# Altium schematic sheet Power Supply.SchDoc
size A4
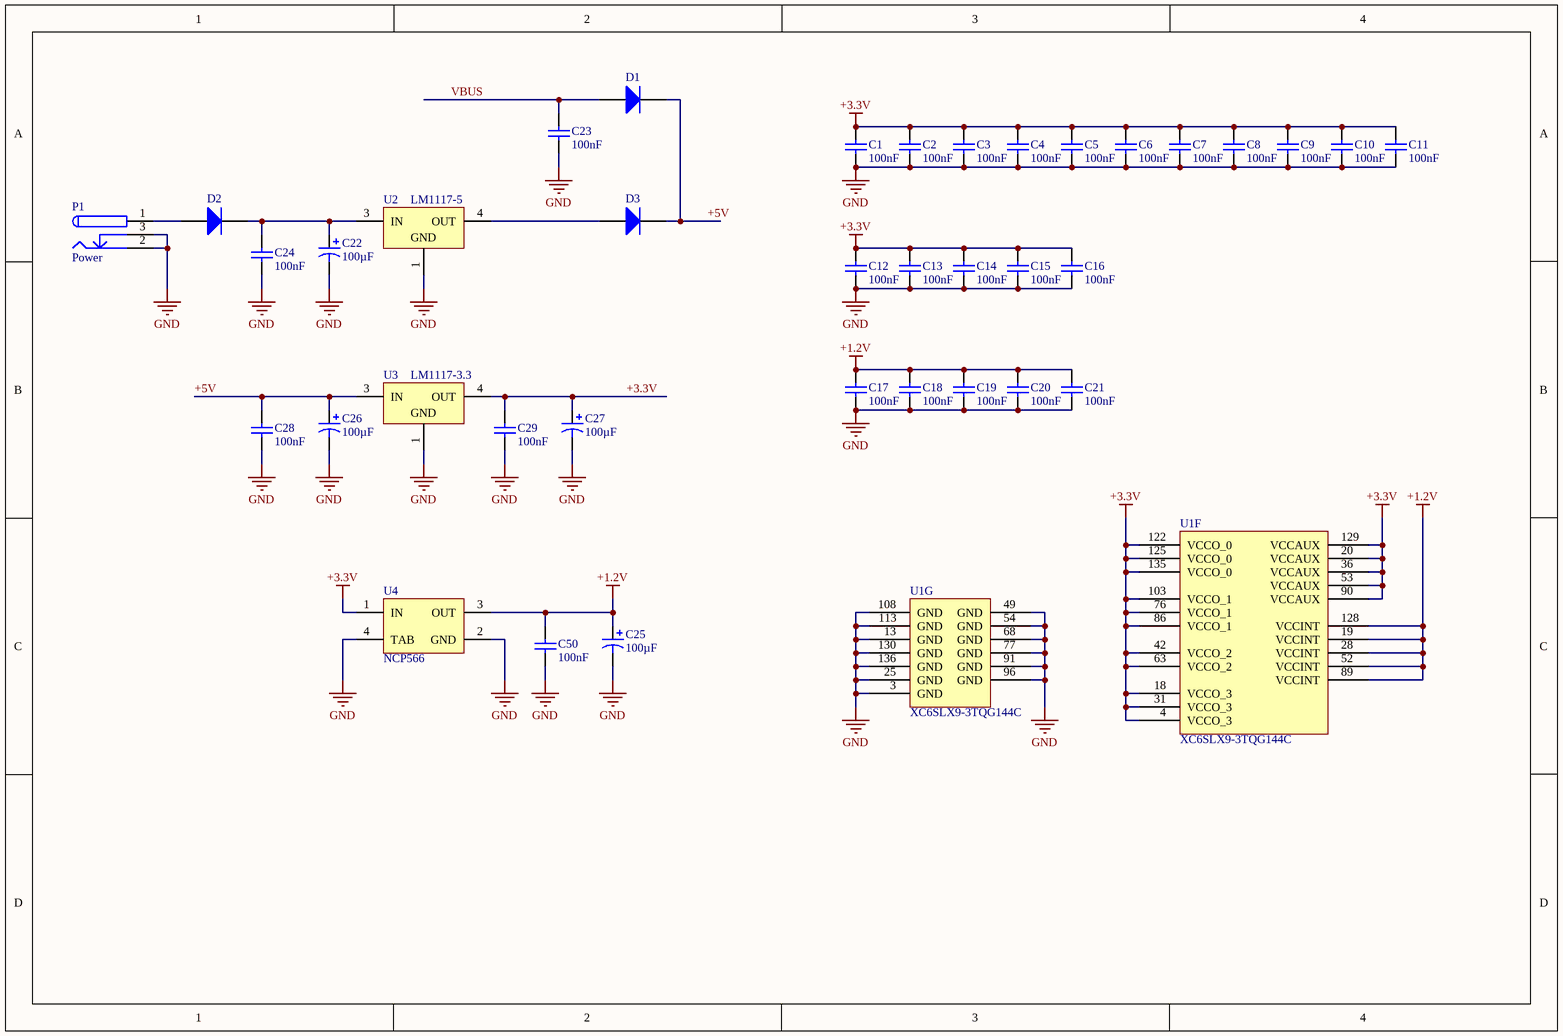
[diagram p0: Power Supply.SchDoc]

## Parts
C1  value 100nF  [6-0805_n]  (hidden comment: Cap)
C2  value 100nF  [6-0805_n]  (hidden comment: Cap)
C3  value 100nF  [6-0805_n]  (hidden comment: Cap)
C4  value 100nF  [6-0805_n]  (hidden comment: Cap)
C5  value 100nF  [6-0805_n]  (hidden comment: Cap)
C6  value 100nF  [6-0805_n]  (hidden comment: Cap)
C7  value 100nF  [6-0805_n]  (hidden comment: Cap)
C8  value 100nF  [6-0805_n]  (hidden comment: Cap)
C9  value 100nF  [6-0805_n]  (hidden comment: Cap)
C10  value 100nF  [6-0805_n]  (hidden comment: Cap)
C11  value 100nF  [6-0805_n]  (hidden comment: Cap)
C12  value 100nF  [6-0805_n]  (hidden comment: Cap)
C13  value 100nF  [6-0805_n]  (hidden comment: Cap)
C14  value 100nF  [6-0805_n]  (hidden comment: Cap)
C15  value 100nF  [6-0805_n]  (hidden comment: Cap)
C16  value 100nF  [6-0805_n]  (hidden comment: Cap)
C17  value 100nF  [6-0805_n]  (hidden comment: Cap)
C18  value 100nF  [6-0805_n]  (hidden comment: Cap)
C19  value 100nF  [6-0805_n]  (hidden comment: Cap)
C20  value 100nF  [6-0805_n]  (hidden comment: Cap)
C21  value 100nF  [6-0805_n]  (hidden comment: Cap)
C22  value 100µF  [ECAP 6.3mm]  (hidden comment: Cap Pol3)
C23  value 100nF  [6-0805_n]  (hidden comment: Cap)
C24  value 100nF  [6-0805_n]  (hidden comment: Cap)
C25  value 100µF  [ECAP 6.3mm]  (hidden comment: Cap Pol3)
C26  value 100µF  [ECAP 6.3mm]  (hidden comment: Cap Pol3)
C27  value 100µF  [ECAP 6.3mm]  (hidden comment: Cap Pol3)
C28  value 100nF  [6-0805_n]  (hidden comment: Cap)
C29  value 100nF  [6-0805_n]  (hidden comment: Cap)
C50  value 100nF  [6-0805_n]  (hidden comment: Cap)
D1  Diode  [SMB]  (value not drawn)
D2  Diode  [SMB]  (value not drawn)
D3  Diode  [SMB]  (value not drawn)
P1  Power  [Power Jack]
U1  XC6SLX9-3TQG144C  [TQG144_N]  (parts F,G of 7)
U2  LM1117-5  [TD03B_M]
U3  LM1117-3.3  [TD03B_M]
U4  NCP566  [SOT223]

## Nets
+1.2V: C17.2 C18.2 C19.2 C20.2 C21.2 C25.1 C50.2 U1.19(VCCINT) U1.28(VCCINT) U1.52(VCCINT) U1.89(VCCINT) U1.128(VCCINT) U4.3(OUT)
+3.3V: C1.2 C2.2 C3.2 C4.2 C5.2 C6.2 C7.2 C8.2 C9.2 C10.2 C11.2 C12.2 C13.2 C14.2 C15.2 C16.2 C27.1 C29.2 U1.4(VCCO_3) U1.18(VCCO_3) U1.20(VCCAUX) U1.31(VCCO_3) U1.36(VCCAUX) U1.42(VCCO_2) U1.53(VCCAUX) U1.63(VCCO_2) U1.76(VCCO_1) U1.86(VCCO_1) U1.90(VCCAUX) U1.103(VCCO_1) U1.122(VCCO_0) U1.125(VCCO_0) U1.129(VCCAUX) U1.135(VCCO_0) U3.4(OUT) U4.1(IN)
GND: C1.1 C2.1 C3.1 C4.1 C5.1 C6.1 C7.1 C8.1 C9.1 C10.1 C11.1 C12.1 C13.1 C14.1 C15.1 C16.1 C17.1 C18.1 C19.1 C20.1 C21.1 C22.2 C23.1 C24.1 C25.2 C26.2 C27.2 C28.1 C29.1 C50.1 P1.2 P1.3 U1.3(GND) U1.13(GND) U1.25(GND) U1.49(GND) U1.54(GND) U1.68(GND) U1.77(GND) U1.91(GND) U1.96(GND) U1.108(GND) U1.113(GND) U1.130(GND) U1.136(GND) U2.1(GND) U3.1(GND) U4.2(GND) U4.4(TAB)
+5V: C26.1 C28.2 D1.2(K) D3.2(K) U3.3(IN)
VBUS: C23.2 D1.1(A)
NetC22_1: C22.1 C24.2 D2.2(K) U2.3(IN)
NetD2_1: D2.1(A) P1.1
NetD3_1: D3.1(A) U2.4(OUT)

## Notes on the sheet
- Title
- Size:
- Date:
- A4
- Number:
- Time:
- Revision:
- Sheet
- of
- File:

## Library data of the parts
C1-C21 C23 C24 C28 C29 C50 = Cap: Capacitor; Published: 8-Jun-2000; LatestRevisionDate: 17-Jul-2002; LatestRevisionNote: Re-released for DXP Platform.; PackageReference: RAD-0.3; Publisher: Altium Limited; PackageDescription: Radial Cap, Thru-Hole; 2 Leads; 0.3 in Pin Spacing
C22 C25-C27 = Cap Pol3: Polarized Capacitor (Surface Mount); Published: 8-Jun-2000; LatestRevisionDate: 29-May-2009; LatestRevisionNote: IPC-7351 Footprint Added.; PackageReference: C0805; Publisher: Altium Limited; PackageDescription: Chip Capacitor
D1-D3 = Diode: Default Diode; Published: 8-Jun-2000; LatestRevisionDate: 17-Jul-2002; LatestRevisionNote: Re-released for DXP Platform.; PackageVersion: Sep-1996; PackageReference: SMC; Publisher: Altium Limited; PackageDescription: DO-214-AB/SMC; 2 C-Bend Leads; Body 7.9 x 5.9 mm, inc. leads (LxW); Code_JEDEC: DO-214-AB
P1 = Power Jack
U1 = XC6SLX9-3TQG144C: Spartan-6 LX 1.2V FPGA, 102 User I/Os, 144-Pin TQFP (0.5mm Pitch), Speed Grade 3, Commercial Grade, Pb-Free; Published: 17-Nov-2009; DatasheetVersion: ver1.6, Nov-2010; PackageVersion: ver1.2, Jun-2004; PackageReference: TQG144; Publisher: Altium Limited; PackageDescription: 144-Pin Thin Quad Flat Pack (TQG144) - Pb-Free; Supplier 1: Digi-Key; Supplier Part Number 1: XC6SLX9-3TQG144C-ND; Code_JEDEC: MS-026-BFB; ComponentLink1Description: Manufacturer Link; ComponentLink1URL: http://www.xilinx.com; ComponentLink2Description: Spartan-6 Datasheet; ComponentLink2URL: http://www.xilinx.com/support/documentation/data_sheets/ds160.pdf; ComponentLink3Description: Spartan-6 Documents; ComponentLink3URL: http://www.xilinx.com/support/documentation/spartan-6.htm; ComponentLink4Description: Xilinx.com Home; ComponentLink4URL: http://www.xilinx.com
U2 U3 = LM1117DT-3.3: 800mA Low-Dropout Linear Regulator, 3-pin TO-252; Manufacturer: National Semiconductor; PackageTopMarking: NSUZXYTT*LM1117*DT-3.3; PowerWise: N; CompType: LDO IC; Published: 4-Dec-2008; DatasheetVersion: Apr-2006; PackageVersion: revD, Feb-2009; PackageReference: TD03B; Publisher: Altium Limited; PackageDescription: TO252, Molded, Jedec, 6.8 x 6.10 x 2.30mm Body, 3 Lead, 2.28mm Pitch, Surface Mount; Supplier 1: Farnell; Supplier Part Number 1: 9486275; Supplier 2: Farnell; Supplier Part Number 2: 1523829; PartNumber: LM1117DT-3.3; RoHS: N; PinCount: 3; Code_JEDEC: TO-252-AA; ComponentLink1Description: LM1117 Datasheet; ComponentLink1URL: http://www.national.com/ds/LM/LM1117.pdf; ComponentLink2Description: LM1117 Web Page; ComponentLink2URL: http://www.national.com/pf/LM/LM1117.html; ComponentLink3Description: TD03B Package Page; ComponentLink3URL: http://www.national.com/packaging/folders/td03b.html